# Altium schematic sheet Main_Board.SchDoc
size A2
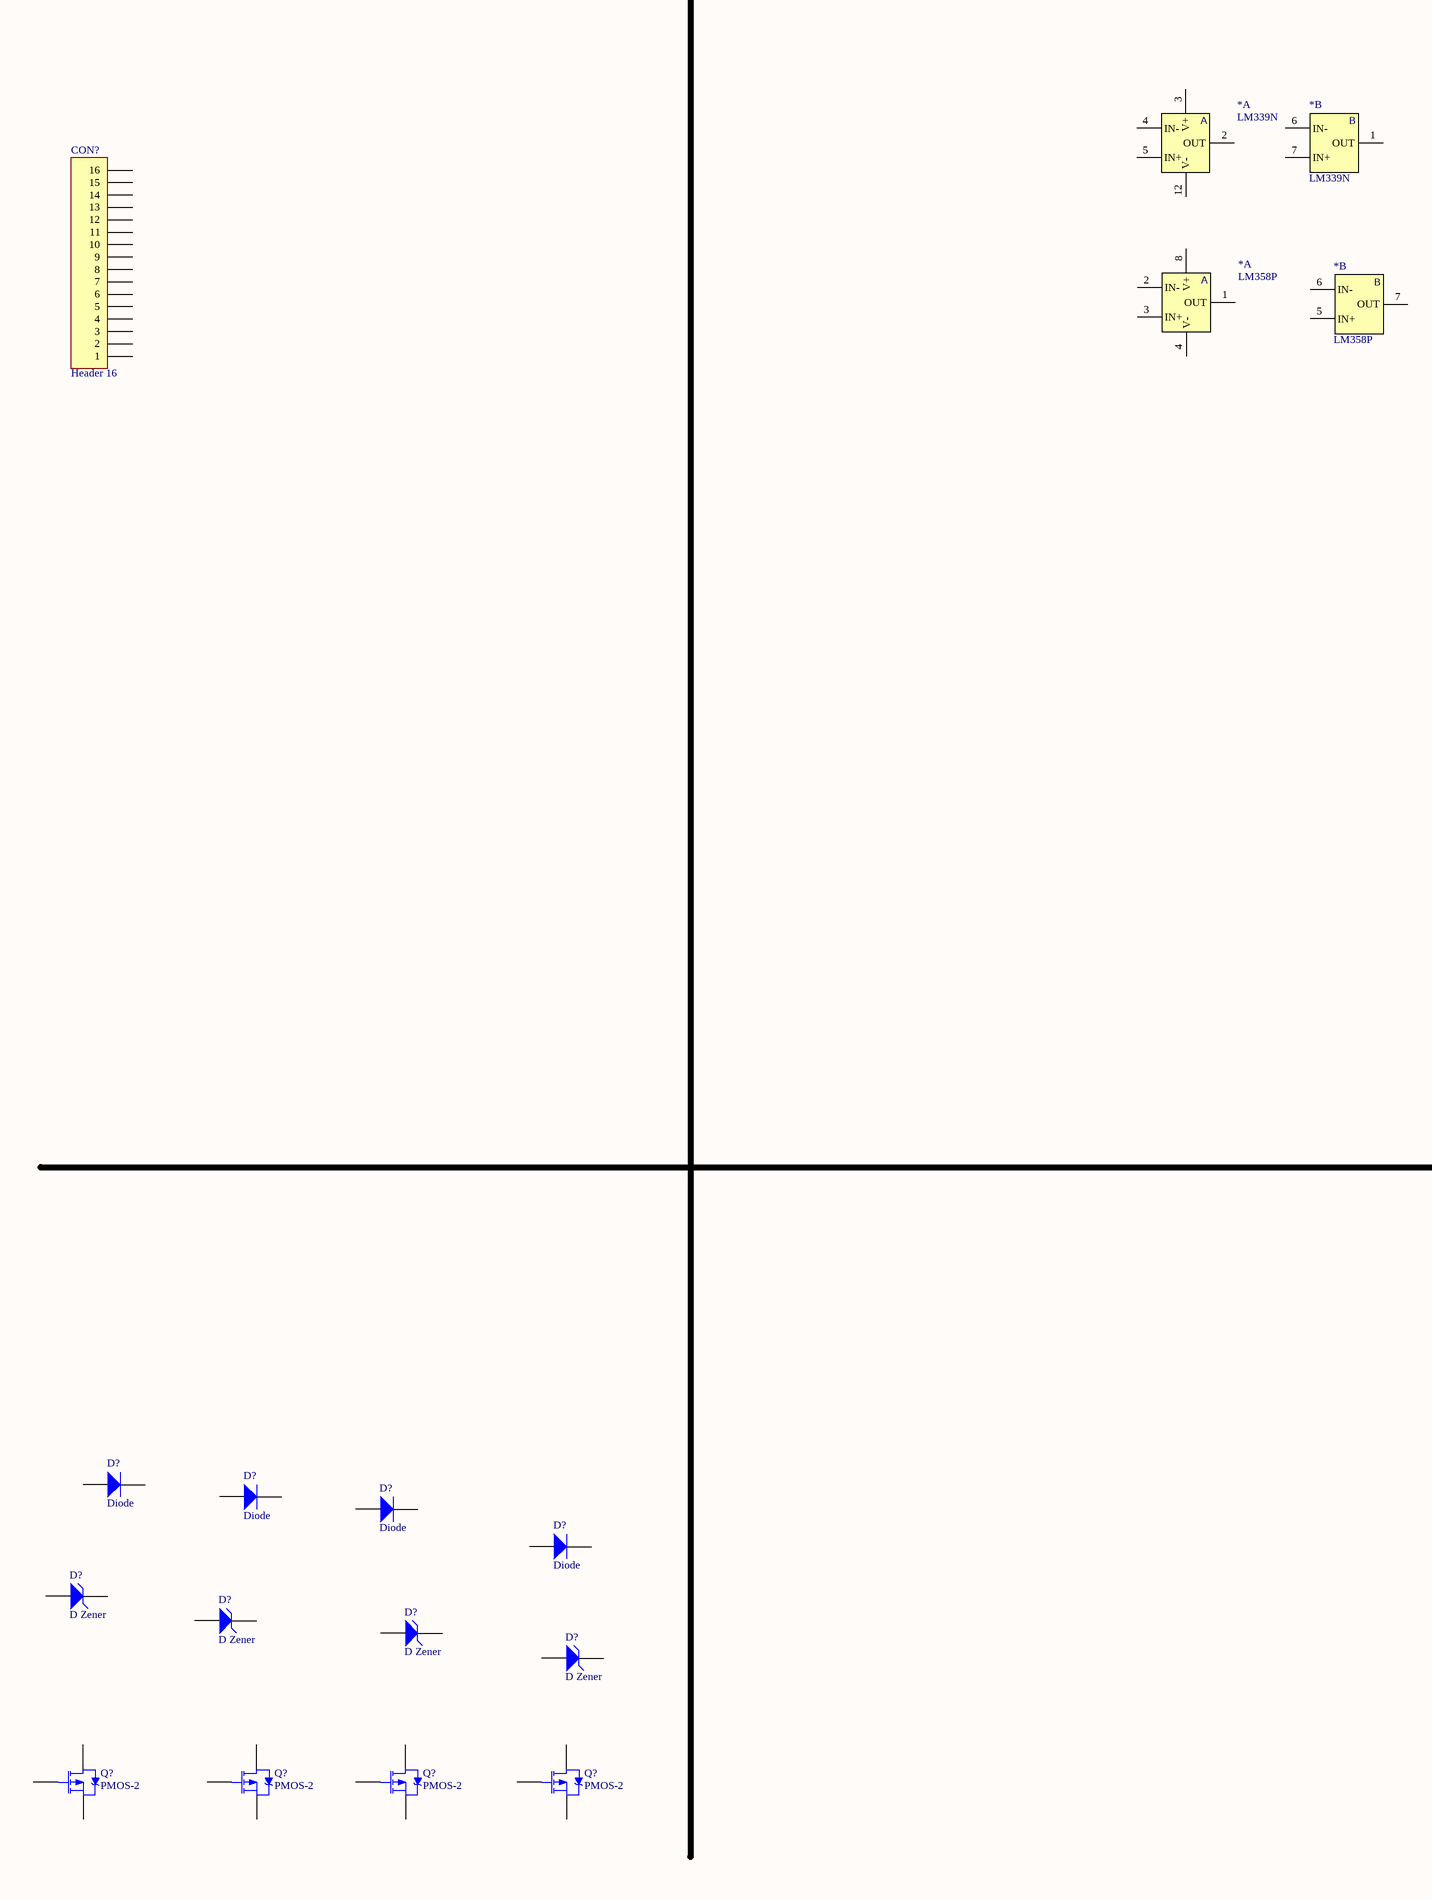
[diagram p0: Main_Board.SchDoc, left]
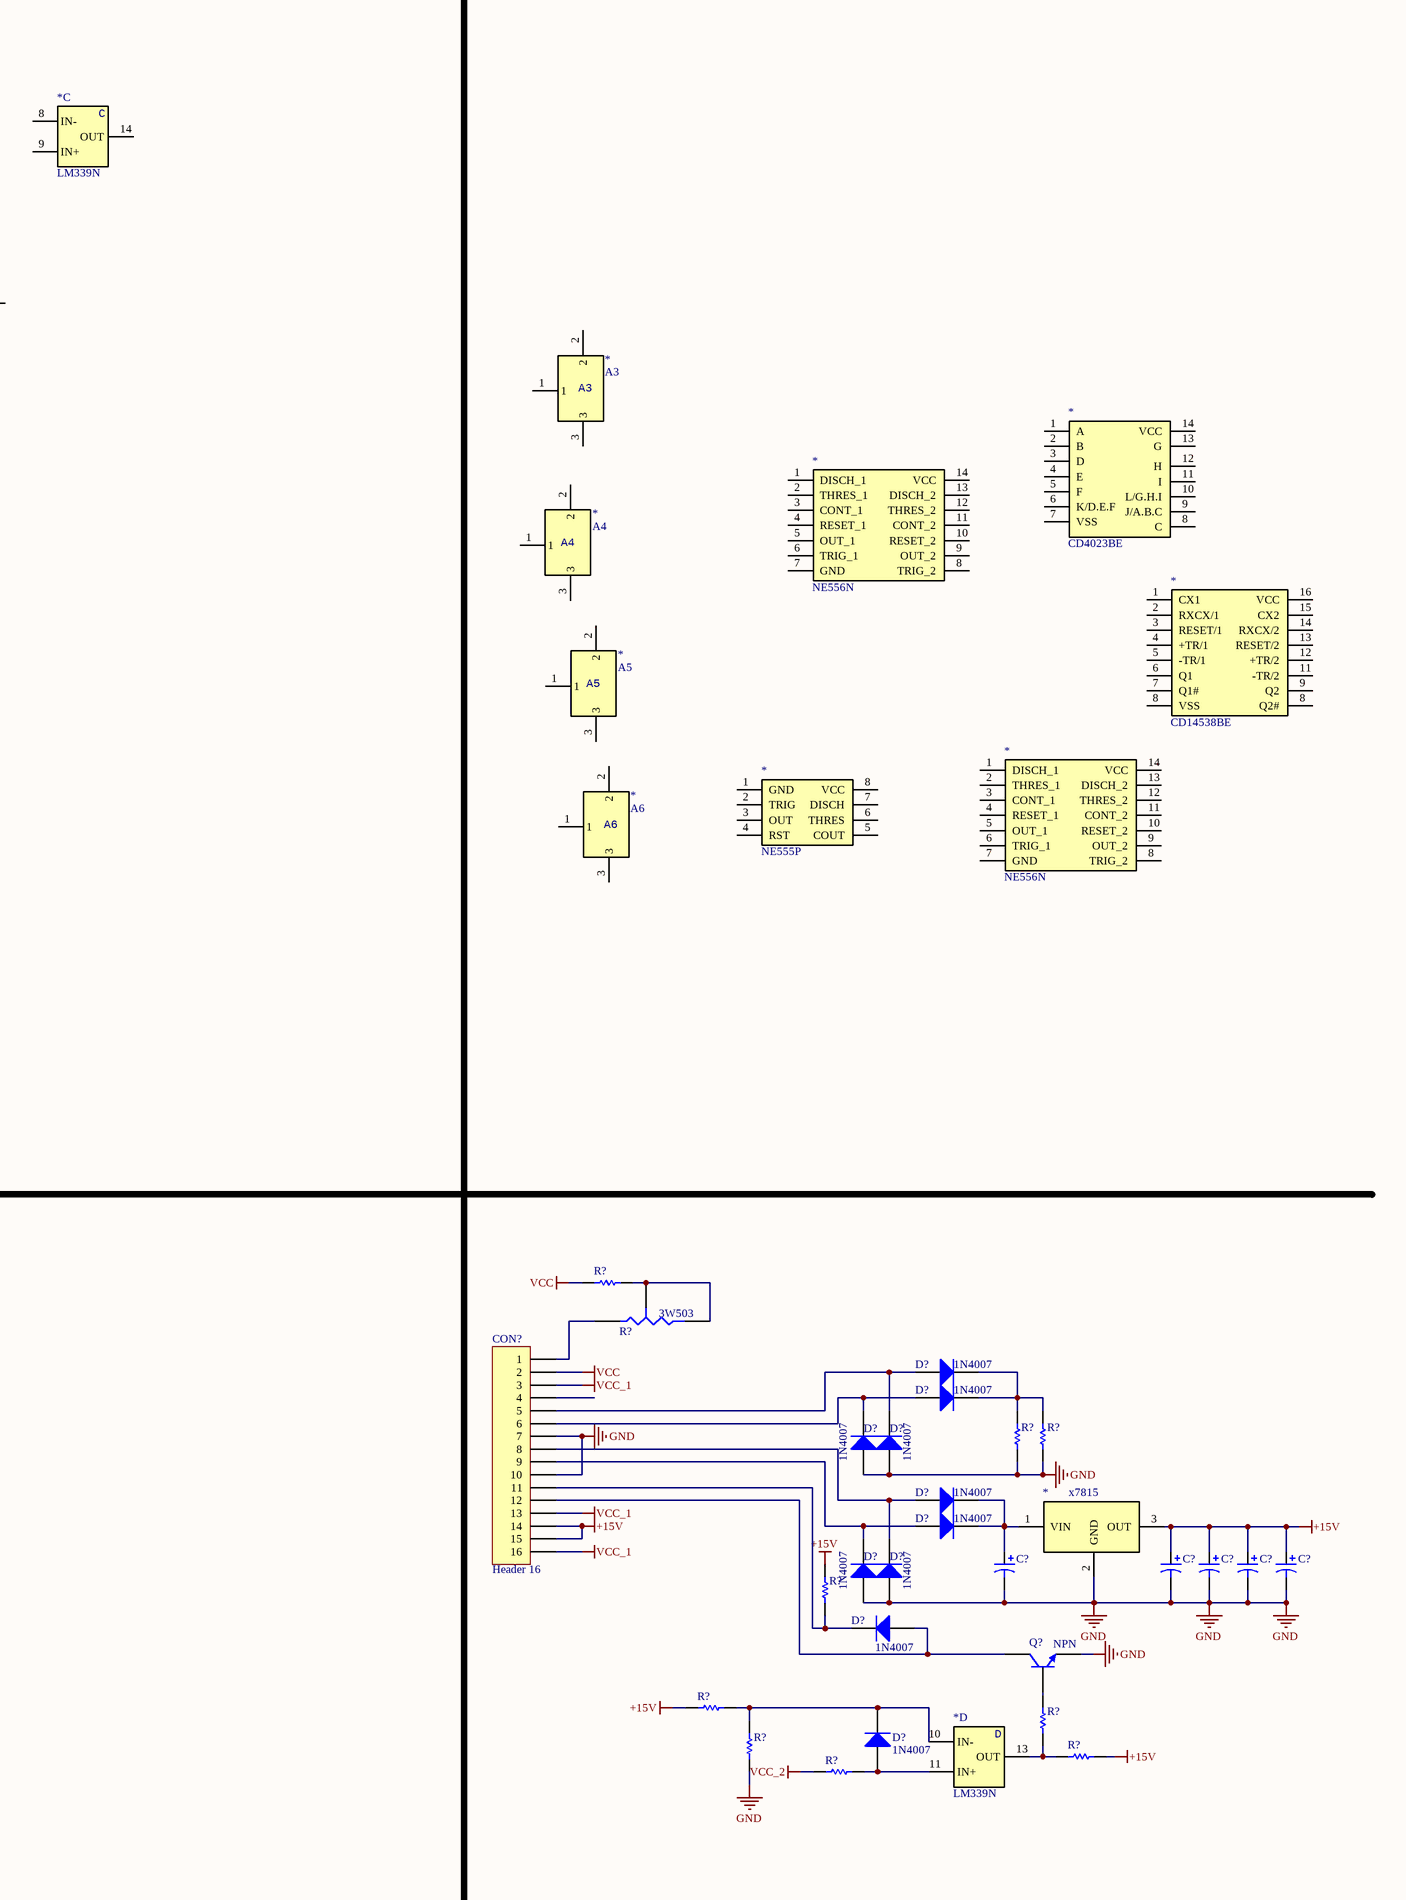
[diagram p1: Main_Board.SchDoc, right]

## Parts
(Parts that share a designator on the sheet are numbered #1, #2 ... from top to bottom, then left to right.)
*#1  LM339N  [DIP14]  (part A of 4)
*#2  LM339N  [DIP14]  (part B of 4)
*#3  LM339N  [DIP14]  (part C of 4)
*#4  LM358P  [DIP8]  (part A of 2)
*#5  LM358P  [DIP8]  (part B of 2)
*#6  A3
*#7  CD4023BE  [DIP14]
*#8  NE556N  [DIP14]
*#9  A4
*#10  CD14538BE
*#11  A5
*#12  NE556N  [DIP14]
*#13  NE555P  [DIP8]
*#14  A6
*#15  x7815
*#16  LM339N  [DIP14]  (part D of 4)
C?#1  (no value)  [RB7.6-15]
C?#2  (no value)  [RB7.6-15]
C?#3  (no value)  [RB7.6-15]
C?#4  (no value)  [RB7.6-15]
C?#5  (no value)  [RB7.6-15]
CON?#1  Header 16  [HDR1X16]
CON?#2  Header 16  [HDR1X16]
D?#1  1N4007  [SMC]
D?#2  1N4007  [SMC]
D?#3  1N4007  [SMC]
D?#4  1N4007  [SMC]
D?#5  1N4007  [SMC]
D?#6  Diode  [SMC]
D?#7  1N4007  [SMC]
D?#8  Diode  [SMC]
D?#9  Diode  [SMC]
D?#10  Diode  [SMC]
D?#11  1N4007  [SMC]
D?#12  1N4007  [SMC]
D?#13  D Zener  [DIODE-0.7]
D?#14  1N4007  [SMC]
D?#15  D Zener  [DIODE-0.7]
D?#16  D Zener  [DIODE-0.7]
D?#17  D Zener  [DIODE-0.7]
D?#18  1N4007  [SMC]
Q?#1  NPN  [TO-226-AA]
Q?#2  PMOS-2  [TO-220AB]
Q?#3  PMOS-2  [TO-220AB]
Q?#4  PMOS-2  [TO-220AB]
Q?#5  PMOS-2  [TO-220AB]
R?#1  (no value)  [AXIAL-0.3]
R?#2  3W503  [VR3]
R?#3  (no value)  [AXIAL-0.3]
R?#4  (no value)  [AXIAL-0.3]
R?#5  (no value)  [AXIAL-0.3]
R?#6  (no value)  [AXIAL-0.3]
R?#7  (no value)  [AXIAL-0.3]
R?#8  (no value)  [AXIAL-0.3]
R?#9  (no value)  [AXIAL-0.3]
R?#10  (no value)  [AXIAL-0.3]

## Nets
+15V: *#15.3(OUT) C?#2.1 C?#3.1 C?#4.1 C?#5.1 CON?#2.14 CON?#2.15 R?#5.2 R?#6.1 R?#9.2
GND: *#15.2(GND) C?#1.2 C?#2.2 C?#3.2 C?#4.2 C?#5.2 CON?#2.7 CON?#2.10 D?#3.1(A) D?#4.1(A) D?#11.1(A) D?#12.1(A) Q?#1.3(E) R?#3.1 R?#4.1 R?#8.2
VCC: CON?#2.2 R?#1.1
VCC_1: CON?#2.3 CON?#2.13 CON?#2.16
VCC_2: R?#10.2
Net*#15_1: *#15.1(VIN) C?#1.1 D?#5.2(K) D?#7.2(K)
Net*#16_10: *#16.10(IN-) D?#18.2(K) R?#6.2 R?#8.1
Net*#16_11: *#16.11(IN+) D?#18.1(A) R?#10.1
Net*#16_13: *#16.13(OUT) R?#7.2 R?#9.1
NetCON?#2_1: CON?#2.1 R?#2.1(A)
NetCON?#2_5: CON?#2.5 D?#1.1(A) D?#4.2(K)
NetCON?#2_6: CON?#2.6 D?#2.1(A) D?#3.2(K)
NetCON?#2_8: CON?#2.8 D?#5.1(A) D?#12.2(K)
NetCON?#2_9: CON?#2.9 D?#7.1(A) D?#11.2(K)
NetCON?#2_11: CON?#2.11 D?#14.2(K) R?#5.1
NetCON?#2_12: CON?#2.12 D?#14.1(A) Q?#1.1(C)
NetD?#1_2: D?#1.2(K) D?#2.2(K) R?#3.2 R?#4.2
NetQ?#1_2: Q?#1.2(B) R?#7.1
NetR?#1_2: R?#1.2 R?#2.2(B) R?#2.3(TAP)

Not connected (* = marked no-connect by the designer): *#1 2(OUT) 3(V+) 4(IN-) 5(IN+) 12(V-); *#2 1(OUT) 6(IN-) 7(IN+); *#3 8(IN-) 9(IN+) 14(OUT); *#4 1(OUT) 2(IN-) 3(IN+) 4(V-) 8(V+); *#5 5(IN+) 6(IN-) 7(OUT); *#6 1 2 3; *#7 1(A) 2(B) 3(D) 4(E) 5(F) 6(K/D.E.F) 7(VSS) 8(C) 9(J/A.B.C) 10(L/G.H.I) 11(I) 12(H) 13(G) 14(VCC); *#8 1(DISCH_1) 2(THRES_1) 3(CONT_1) 4(RESET_1) 5(OUT_1) 6(TRIG_1) 7(GND) 8(TRIG_2) 9(OUT_2) 10(RESET_2) 11(CONT_2) 12(THRES_2) 13(DISCH_2) 14(VCC); *#9 1 2 3; *#10 1(CX1) 2(RXCX/1) 3(RESET/1) 4(+TR/1) 5(-TR/1) 6(Q1) 7(Q1#) 8(VSS) 9(Q2) 11(-TR/2) 12(+TR/2) 13(RESET/2) 14(RXCX/2) 15(CX2) 16(VCC); *#11 1 2 3; *#12 1(DISCH_1) 2(THRES_1) 3(CONT_1) 4(RESET_1) 5(OUT_1) 6(TRIG_1) 7(GND) 8(TRIG_2) 9(OUT_2) 10(RESET_2) 11(CONT_2) 12(THRES_2) 13(DISCH_2) 14(VCC); *#13 1(GND) 2(TRIG) 3(OUT) 4(RST) 5(COUT) 6(THRES) 7(DISCH) 8(VCC); *#14 1 2 3; CON?#1 1 2 3 4 5 6 7 8 9 10 11 12 13 14 15 16; CON?#2 4; D?#6 1(A) 2(K); D?#8 1(A) 2(K); D?#9 1(A) 2(K); D?#10 1(A) 2(K); D?#13 1(A) 2(K); D?#15 1(A) 2(K); D?#16 1(A) 2(K); D?#17 1(A) 2(K); Q?#2 1(G) 2(D) 3(S); Q?#3 1(G) 2(D) 3(S); Q?#4 1(G) 2(D) 3(S); Q?#5 1(G) 2(D) 3(S)

## Notes on the sheet
- (in symbol LM339N_1, part A) A
- (in symbol LM339N_1, part B) B
- (in symbol LM339N_1, part C) C
- (in symbol LM339N_1, part D) D
- (in symbol LM358P_1, part A) A
- (in symbol LM358P_1, part B) B

## Library data of the parts
*#1-*#3 *#16 = LM339N_1
*#4 *#5 = LM358P_1
C?#1-C?#5 = Cap Pol1: Polarized Capacitor (Radial); Published: 8-Jun-2000; LatestRevisionDate: 17-Jul-2002; LatestRevisionNote: Re-released for DXP Platform.; PackageReference: RB7.6-15; Publisher: Altium Limited; PackageDescription: Polarized Capacitor (Radial); 2 Leads
CON?#1 CON?#2 = Header 16: Header, 16-Pin; LatestRevisionDate: 17-Jul-2002; LatestRevisionNote: Re-released for DXP Platform.; Publisher: Altium Limited
D?#1-D?#12 D?#14 D?#18 = Diode: Default Diode; Published: 8-Jun-2000; LatestRevisionDate: 17-Jul-2002; LatestRevisionNote: Re-released for DXP Platform.; PackageVersion: Sep-1996; PackageReference: SMC; Publisher: Altium Limited; PackageDescription: DO-214-AB/SMC; 2 C-Bend Leads; Body 7.9 x 5.9 mm, inc. leads (LxW); Code_JEDEC: DO-214-AB
D?#13 D?#15-D?#17 = D Zener: Zener Diode; Published: 8-Jun-2000; LatestRevisionDate: 17-Jul-2002; LatestRevisionNote: Re-released for DXP Platform.; PackageReference: DIODE-0.7; Publisher: Altium Limited; PackageDescription: Diode, Thru-Hole; 2 Leads; 0.7 in Pin Spacing
Q?#1 = NPN: NPN Bipolar Transistor; Published: 8-Jun-2000; LatestRevisionDate: 17-Jul-2002; LatestRevisionNote: Re-released for DXP Platform.; PackageReference: TO-226-AA; Publisher: Altium Limited; PackageDescription: TO, Flat Index; 3 In-Line, Axial Leads; Body Dia. 4.8mm; Leads 0.55 x 0.51 mm (max); Code_JEDEC: TO-226-AA
Q?#2-Q?#5 = PMOS-2: P-Channel Power MOSFET; Note: Pin 4 not drawn and electrically connected to Pin 2.; Published: 8-Jun-2000; LatestRevisionDate: 17-Jul-2002; LatestRevisionNote: Re-released for DXP Platform.; DatasheetVersion: PD-9.390D; PackageVersion: Feb-1997; PackageReference: TO-220AB; Publisher: Altium Limited; PackageDescription: TO, Thru-Hole, Vertical, Heatsink Mounted; 3 In-Line Leads; Pitch 2.54 mm; ComponentLink1Description: Manufacturer Link; ComponentLink1URL: http://www.irf.com/
R?#1 R?#3-R?#10 = Res1: Resistor; Published: 8-Jun-2000; LatestRevisionDate: 17-Jul-2002; LatestRevisionNote: Re-released for DXP Platform.; PackageReference: AXIAL-0.3; Publisher: Altium Limited; PackageDescription: Axial Device, Thru-Hole; 2 Leads; 0.3 in Pin Spacing
R?#2 = Res Tap: Tapped Resistor; Sim Note: Enter the Resistance value and the set point into parameter fields.; Set Position: 0.5; Published: 24-Mar-1999; LatestRevisionDate: 17-Jul-2002; LatestRevisionNote: Re-released for DXP Platform.; PackageReference: VR3; Publisher: Altium Limited; PackageDescription: Variable Resistor, Thru-Hole; 3 Leads